# Altium schematic sheet IO Connector.SchDoc
size A4; SheetNumber: 4; SheetTotal: 4
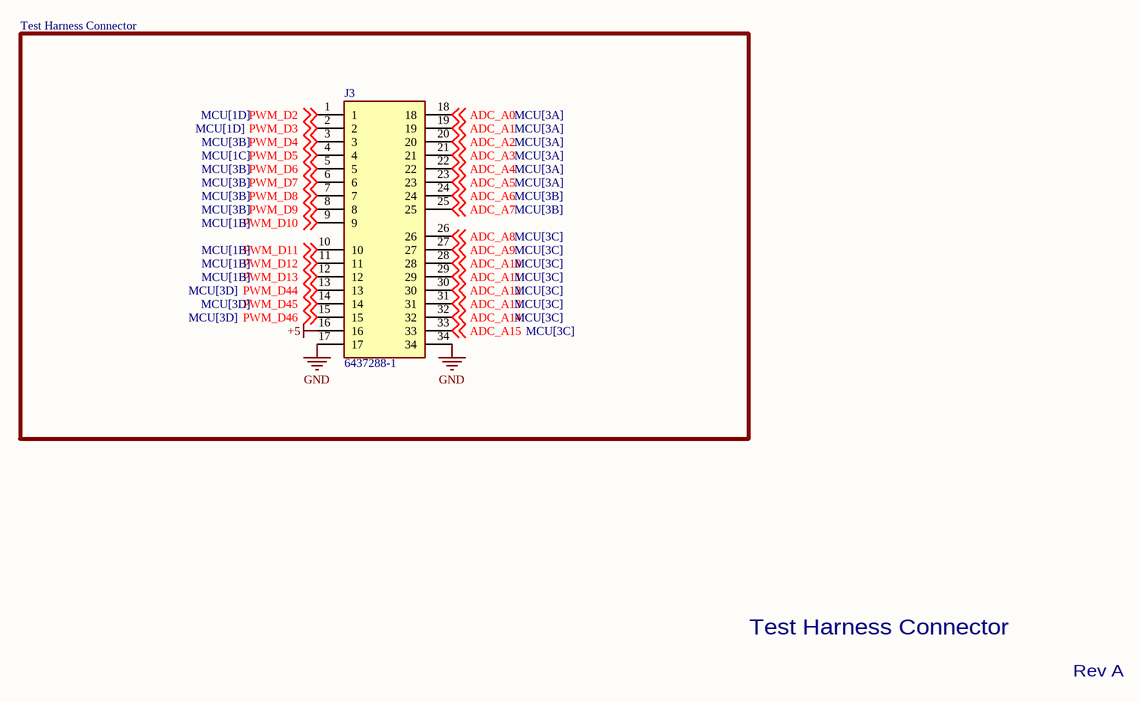
[diagram p0: IO Connector.SchDoc]

## Parts
J3  6437288-1  [TE_6437288-1]

## Blocks framed on the sheet
Test Harness Connector: J3

## Nets
+5: J3.16
GND: J3.17 J3.34
ADC_A0: J3.18 ; off-sheet ADC_A0
ADC_A1: J3.19 ; off-sheet ADC_A1
ADC_A2: J3.20 ; off-sheet ADC_A2
ADC_A3: J3.21 ; off-sheet ADC_A3
ADC_A4: J3.22 ; off-sheet ADC_A4
ADC_A5: J3.23 ; off-sheet ADC_A5
ADC_A6: J3.24 ; off-sheet ADC_A6
ADC_A7: J3.25 ; off-sheet ADC_A7
ADC_A8: J3.26 ; off-sheet ADC_A8
ADC_A9: J3.27 ; off-sheet ADC_A9
ADC_A10: J3.28 ; off-sheet ADC_A10
ADC_A11: J3.29 ; off-sheet ADC_A11
ADC_A12: J3.30 ; off-sheet ADC_A12
ADC_A13: J3.31 ; off-sheet ADC_A13
ADC_A14: J3.32 ; off-sheet ADC_A14
ADC_A15: J3.33 ; off-sheet ADC_A15
PWM_D2: J3.1 ; off-sheet PWM_D2
PWM_D3: J3.2 ; off-sheet PWM_D3
PWM_D4: J3.3 ; off-sheet PWM_D4
PWM_D5: J3.4 ; off-sheet PWM_D5
PWM_D6: J3.5 ; off-sheet PWM_D6
PWM_D7: J3.6 ; off-sheet PWM_D7
PWM_D8: J3.7 ; off-sheet PWM_D8
PWM_D9: J3.8 ; off-sheet PWM_D9
PWM_D10: J3.9 ; off-sheet PWM_D10
PWM_D11: J3.10 ; off-sheet PWM_D11
PWM_D12: J3.11 ; off-sheet PWM_D12
PWM_D13: J3.12 ; off-sheet PWM_D13
PWM_D44: J3.13 ; off-sheet PWM_D44
PWM_D45: J3.14 ; off-sheet PWM_D45
PWM_D46: J3.15 ; off-sheet PWM_D46

## Notes on the sheet
- Test Harness Connector
- Rev A

## Library data of the parts
J3 = 6437288-1: 34 Position 4 Row Right Angle Receptacle Through Hole Super Seal Cap Assy; MF: {'manufacturer': u'TE Connectivity'}; Package: None; Price: None; Value: *; MP: 6437288-1; Availability: Unavailable